# Altium schematic sheet mmu_top.SchDoc
size A4; SheetNumber: 1; SheetTotal: 4
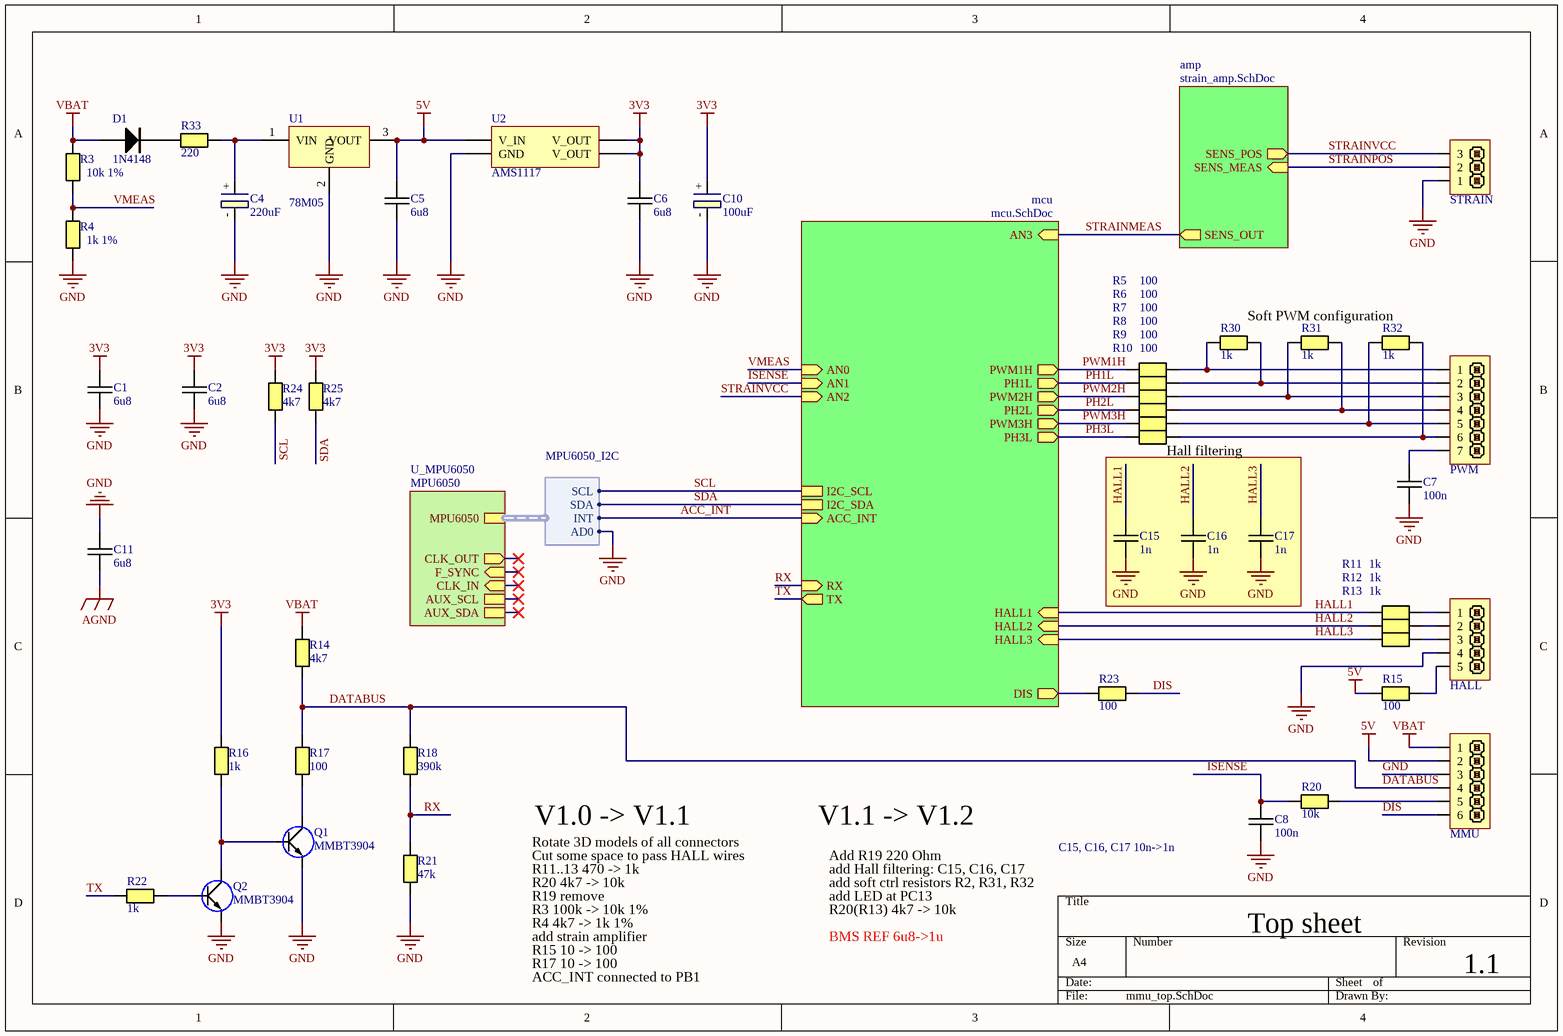
[diagram p0: mmu_top.SchDoc]

## Parts
C1  6u8  [CAPC0805(2012)75_N]
C2  6u8  [CAPC0805(2012)75_N]
C4  220uF  [10x10.5 Capacitor]
C5  6u8  [CAPC0805(2012)75_N]
C6  6u8  [CAPC0805(2012)75_N]
C7  100n  [CAPC0603(1608)55_N]
C8  100n  [CAPC0603(1608)55_N]
C10  100uF  [TC7343]
C11  6u8  [CAPC0805(2012)75_N]
C15  1n  [CAPC0603(1608)55_N]
C16  1n  [CAPC0603(1608)55_N]
C17  1n  [CAPC0603(1608)55_N]
D1  1N4148  [SOD80]
HALL  PIN HEADER 1x5  [XH2.54 5P]  (value not drawn)
MMU  PIN HEADER 1x6  [XH2.54 6P]  (value not drawn)
PWM  PIN HEADER 1x7  [XH2.54 7P]  (value not drawn)
Q1  MMBT3904  [SOT23]
Q2  MMBT3904  [SOT23]
R3  10k 1%  [RESC0603(1608)_N]
R4  1k 1%  [RESC0603(1608)_N]
R5  100  [RESC0603(1608)_N]
R6  100  [RESC0603(1608)_N]
R7  100  [RESC0603(1608)_N]
R8  100  [RESC0603(1608)_N]
R9  100  [RESC0603(1608)_N]
R10  100  [RESC0603(1608)_N]
R11  1k  [RESC0603(1608)_N]
R12  1k  [RESC0603(1608)_N]
R13  1k  [RESC0603(1608)_N]
R14  4k7  [RESC0603(1608)_N]
R15  100  [RESC0603(1608)_N]
R16  1k  [RESC0603(1608)_N]
R17  100  [RESC0603(1608)_N]
R18  390k  [RESC0603(1608)_N]
R20  10k  [RESC0603(1608)_N]
R21  47k  [RESC0603(1608)_N]
R22  1k  [RESC0603(1608)_N]
R23  100  [RESC0603(1608)_N]
R24  4k7  [RESC0603(1608)_N]
R25  4k7  [RESC0603(1608)_N]
R30  1k  [RESC0603(1608)_N]
R31  1k  [RESC0603(1608)_N]
R32  1k  [RESC0603(1608)_N]
R33  220  [RESC2512(6432)_N]
STRAIN  PIN HEADER 1x3  [XH2.54 3P]  (value not drawn)
U1  78M05  [TO-252]
U2  AMS1117  [SOT229P700X180-4N]

## Blocks framed on the sheet
Hall filtering: C15-C17

## Sub-sheets
amp = strain_amp.SchDoc: SENS_OUT (out), SENS_POS (out), SENS_MEAS (in)
mcu = mcu.SchDoc: PWM1H (out), PWM3H (out), PH3L (out), PWM2H (out), DIS (out), PH2L (out), PH1L (out), RX (in), TX (out), AN2 (in), AN1 (in), HALL3 (in), AN3 (in), HALL2 (in), AN0 (in), HALL1 (in), I2C_SCL, I2C_SDA, ACC_INT (in)
U_MPU6050 = MPU6050: MPU6050 (harness MPU6050_I2C), CLK_OUT (out), F_SYNC (in), CLK_IN (in), AUX_SCL, AUX_SDA

## Harnesses
MPU6050_I2C: AD0, INT, SCL, SDA

## Nets
3V3: C1.1 C2.1 C6.1 C10.+ R16.2 R24.2 R25.2 U2.2(V_OUT) U2.4(V_OUT)
5V: C5.1 MMU.2 R15.1 U1.3(VOUT) U2.3(V_IN)
AGND: C11.2
GND: C1.2 C2.2 C4.- C5.2 C6.2 C7.2 C8.2 C10.- C11.1 C15.2 C16.2 C17.2 HALL.4 MMU.3 Q1.2(E) Q2.2(E) R4.1 R21.1 STRAIN.1 U1.2(GND) U2.1(GND) ; sheet U_MPU6050/MPU6050.AD0
VBAT: D1.1(A) MMU.1 R3.2 R14.2
ACC_INT: sheet mcu/ACC_INT, sheet U_MPU6050/MPU6050.INT
DATABUS: MMU.4 R14.1 R17.2 R18.2
DIS: MMU.6 R23.2
HALL1: C15.1 R11.1 ; sheet mcu/HALL1
HALL2: C16.1 R12.1 ; sheet mcu/HALL2
HALL3: C17.1 R13.1 ; sheet mcu/HALL3
ISENSE: C8.1 R20.1 ; sheet mcu/AN1
PH1L: R6.1 ; sheet mcu/PH1L
PH2L: R8.1 ; sheet mcu/PH2L
PH3L: R10.1 ; sheet mcu/PH3L
PWM1H: R5.1 ; sheet mcu/PWM1H
PWM2H: R7.1 ; sheet mcu/PWM2H
PWM3H: R9.1 ; sheet mcu/PWM3H
RX: R18.1 R21.2 ; sheet mcu/RX
SCL: R24.1 ; sheet mcu/I2C_SCL, sheet U_MPU6050/MPU6050.SCL
SDA: R25.1 ; sheet mcu/I2C_SDA, sheet U_MPU6050/MPU6050.SDA
STRAINMEAS: sheet mcu/AN3, sheet amp/SENS_OUT
STRAINPOS: STRAIN.2 ; sheet amp/SENS_MEAS
STRAINVCC: STRAIN.3 ; sheet mcu/AN2, sheet amp/SENS_POS
TX: R22.1 ; sheet mcu/TX
VMEAS: R3.1 R4.2 ; sheet mcu/AN0
NetC4_+: C4.+ R33.2 U1.1(VIN)
NetC7_1: C7.1 PWM.7
NetD1_2: D1.2(K) R33.1
NetHALL_1: HALL.1 R11.2
NetHALL_2: HALL.2 R12.2
NetHALL_3: HALL.3 R13.2
NetHALL_5: HALL.5 R15.2
NetMMU_5: MMU.5 R20.2
NetPWM_1: PWM.1 R5.2 R30.1
NetPWM_2: PWM.2 R6.2 R30.2
NetPWM_3: PWM.3 R7.2 R31.1
NetPWM_4: PWM.4 R8.2 R31.2
NetPWM_5: PWM.5 R9.2 R32.1
NetPWM_6: PWM.6 R10.2 R32.2
NetQ1_1: Q1.1(B) Q2.3(C) R16.1
NetQ1_3: Q1.3(C) R17.1
NetQ2_1: Q2.1(B) R22.2
NetR23_1: R23.1 ; sheet mcu/DIS

## Notes on the sheet
- Soft PWM configuration
- Rotate 3D models of all connectors
- Cut some space to pass HALL wires
- V1.0 -> V1.1
- Add R19 220 Ohm
- V1.1 -> V1.2
- C15, C16, C17 10n->1n
- R11..13 470 -> 1k
- R20 4k7 -> 10k
- R19 remove
- R3 100k -> 10k 1%
- R4 4k7 -> 1k 1%
- add Hall filtering: C15, C16, C17
- add soft ctrl resistors R2, R31, R32
- add LED at PC13
- R20(R13) 4k7 -> 10k
- Top sheet
- add strain amplifier
- R15 10 -> 100
- R17 10 -> 100
- ACC_INT connected to PB1
- BMS REF 6u8->1u
- 1.1

## Library data of the parts
C1 C2 C5-C8 C11 C15-C17 = Capacitor M: Ceramic capacitor Medium density
  C1 C2 C5 C6 C11: Value: 6u8
  C7 C8: Value: 100n
  C15-C17: Value: 1n
C4 C10 = Capacitor Electrolitic
  C4: Value: 220uF
  C10: Value: 100uF
D1 = 1N4148: Small Signal Fast Switching Diodes; Repetitive peak reverse voltage: 100 V; Reverse voltage: 75 V; Peak forward surge current: 2 A; Repetitive peak forward current: 500 mA; Forward continuous current: 300 mA; Average forward current: 150 mA; Diode capacitance: 4 pF; Reverse recovery time: 4 ~ 8 ns; Supplier 1: Mouser; Supplier Part Number 1: 78-MCL4148
HALL = PIN HEADER 2.54 1x5
MMU = PIN HEADER 2.54 1x6
PWM = PIN HEADER 2.54 1x7
Q1 Q2 = 2N3904: NPN General Purpose Transistor; Collector-Emitter Voltage: 40V; Collector-Base Voltage: 60V; Collector Current - Continuous: 200mA; DC Current Gain: 300
R3-R18 R20-R25 R30-R33 = Resistor M: Resistor Medium Density
  R3: Value: 10k 1%
  R4: Value: 1k 1%
  R5-R10 R15 R17 R23: Value: 100
  R11-R13 R16 R22 R30-R32: Value: 1k
  R14 R24 R25: Value: 4k7
  R18: Value: 390k
  R20: Value: 10k
  R21: Value: 47k
  R33: Value: 220
STRAIN = PIN HEADER 2.54 1x3
U1 = 78M05: Linear Voltage Regulator; DC Input Voltage MAX: 30V; Output Current: 300..700mA
U2 = AMS1117: 800mA LDO  15V max